# Altium schematic sheet MPU6050六轴模块.SchDoc
size A4
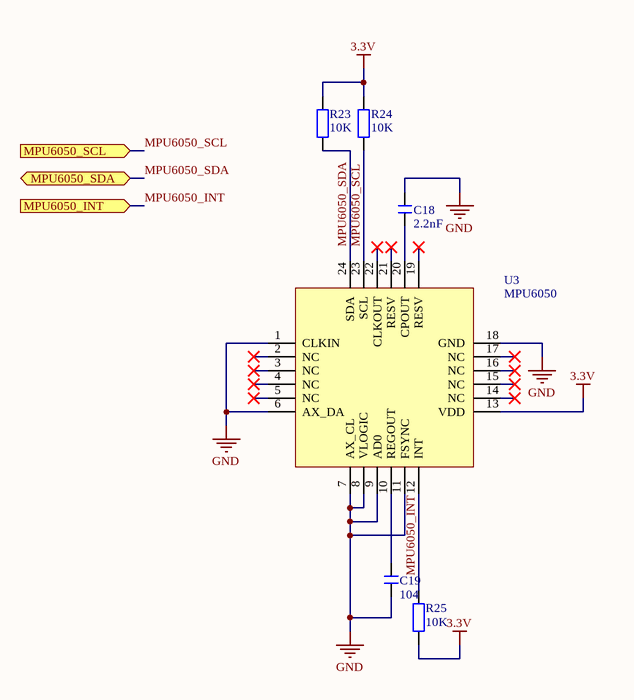
[diagram p0: MPU6050六轴模块.SchDoc]

## Parts
C18  2.2nF  [C 0603_L]
C19  104  [C 0603_L]
R23  10K  [R 0603_L]
R24  10K  [R 0603_L]
R25  10K  [R 0603_L]
U3  MPU6050  [QFN24 4x4_L]

## Ports
MPU6050_INT (in), MPU6050_SCL (in), MPU6050_SDA (bidir)

## Nets
3.3V: R23.2 R24.2 R25.1 U3.13(VDD)
GND: C18.2 C19.1 U3.1(CLKIN) U3.6(AX_DA) U3.7(AX_CL) U3.8(VLOGIC) U3.9(AD0) U3.11(FSYNC) U3.18(GND)
MPU6050_INT: R25.2 U3.12(INT) ; port MPU6050_INT
MPU6050_SCL: R24.1 U3.23(SCL) ; port MPU6050_SCL
MPU6050_SDA: R23.1 U3.24(SDA) ; port MPU6050_SDA
NetC18_1: C18.1 U3.20(CPOUT)
NetC19_2: C19.2 U3.10(REGOUT)

Not connected (* = marked no-connect by the designer): U3 2(NC)* 3(NC)* 4(NC)* 5(NC)* 14(NC)* 15(NC)* 16(NC)* 17(NC)* 19(RESV)* 21(RESV)* 22(CLKOUT)*

## Library data of the parts
C18 C19 = C: 无极性贴片电容; 版权归属: 黎明电子style; BOM名称: 无极性贴片电容; 学习资源: https://lmdzstyle.taobao.com/
R23-R25 = R: 贴片电阻; 版权归属: 黎明电子style; BOM名称: 贴片电阻; 学习资源: https://lmdzstyle.taobao.com/
U3 = MPU6050: 数字运动传感器; 版权归属: 源创客; BOM名称: 数字运动传感器; 学习资源: www.ooocke.com